# EAGLE design DW-01_lithium_protection (EAGLE 7.4.0)
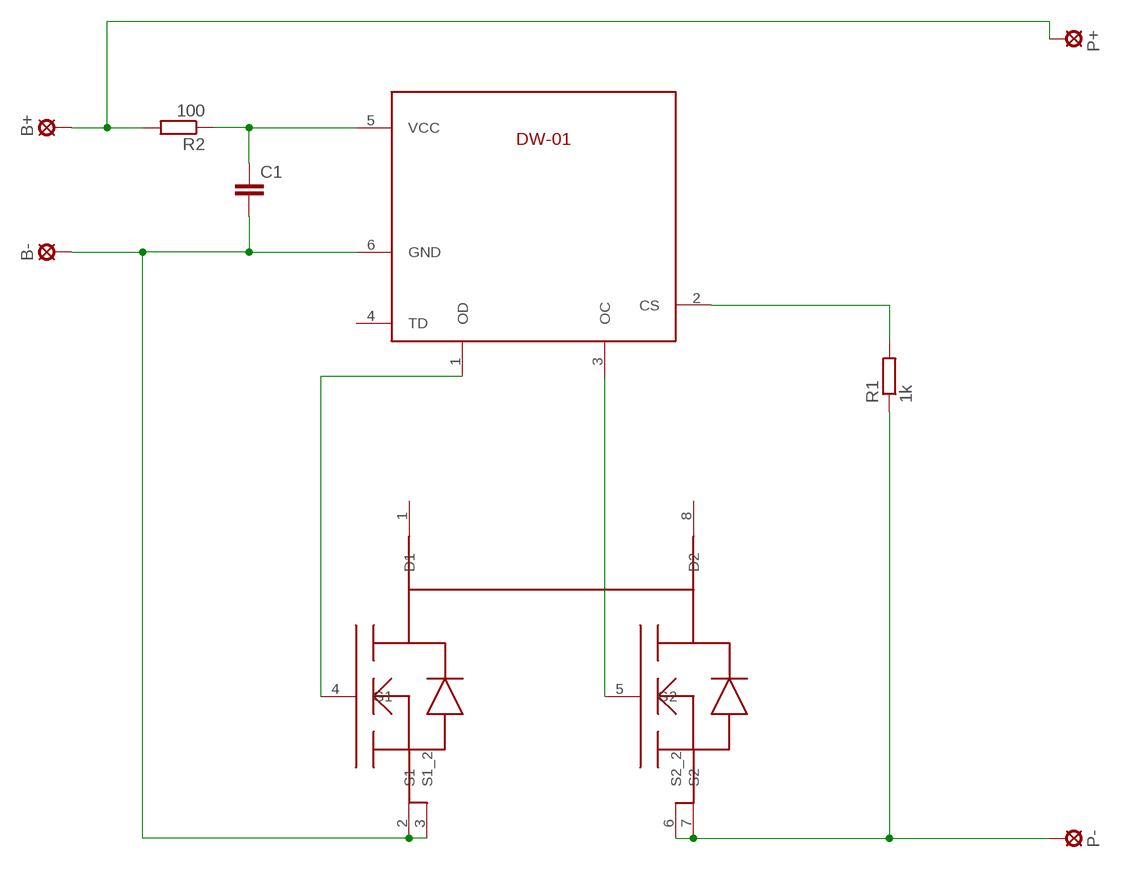
[diagram p0: schematic, sheet 1]

## Parts
B+  LSP10  [LSP10]
B-  LSP10  [LSP10]
C1  C-EUC0603  [C0603]
P+  LSP10  [LSP10]
P-  LSP10  [LSP10]
R1  1k  R-EU_R0603  [R0603]
R2  100  R-EU_R0603  [R0603]
U$1  DW-01  [SOT23-6]
U$2  8205A  [TSSOP8]

## Nets
N$1: U$1.1(OD) U$2.4(G1)
N$2: U$1.3(OC) U$2.5(G2)
N$3: C1.1 R2.1 U$1.5(VCC)
N$4: R1.2 U$1.2(CS)
N$5: P-.MP R1.1 U$2.6(S2_2) U$2.7(S2)
N$6: B-.MP C1.2 U$1.6(GND) U$2.2(S1) U$2.3(S1_2)
N$7: B+.MP P+.MP R2.2
Unconnected: U$1.4(TD) U$2.1(D1) U$2.8(D2)

## Library data of the parts
B+ B- P+ P- = solpad:LSP10: SOLDER PAD drill 1.0 mm, distributor Buerklin, 12H555
C1 = rcl:C-EU: CAPACITOR, European symbol
R1 R2 = rcl:R-EU_: RESISTOR, European symbol
U$1 = DW-01:DW-01
U$2 = 8205A:8205A

## Board
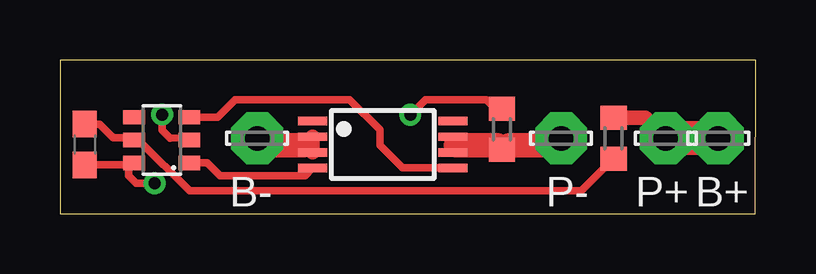
[diagram p1: board, top side]
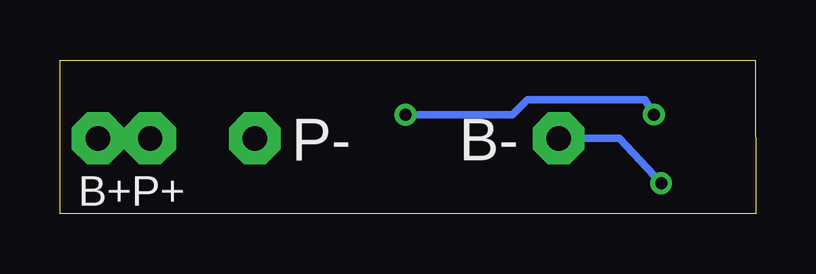
[diagram p2: board, bottom side, seen from below]

Size 29.02 x 6.41 mm. Coordinates in mm from the lower left corner, seen from the top.
Outline: 0,0 29,0 29.02,6.41 0.02,6.41 0,0
Copper layers (1*16): Top 0.035mm / dielectric 1.5mm / Bottom 0.035mm
Design rules "default *": minimum track width 10mil, minimum drill 24mil, track to track 8mil, track to pad 8mil, pad to pad 8mil, via to via 8mil, smd to smd 8mil, copper to edge 40mil, drill to drill 8mil, minimum pad ring 10mil, minimum via ring 8mil, stop-mask expansion 4mil, vias tented up to drill 20mil, thermal gap 10mil

### Footprints (pad centres in the part's own frame; a part is rotated, then mirrored left to right if it is on the bottom)
LSP10 = drill 1.016 pad 2.159 octagon: MP 0,0
C0603 = smd 1.1 x 1: 1 -0.85,0; 2 0.85,0
R0603 = smd 1 x 1.1: 1 -0.85,0; 2 0.85,0
SOT23-6 = smd 0.6 x 0.9: 1 -0.95,-1.15; 2 0,-1.15; 3 0.95,-1.15; 4 0.95,1.15; 5 0,1.15; 6 -0.95,1.15
TSSOP8 = smd 1.2 x 0.35: 1 -2.925,0.975; 2 -2.925,0.325; 3 -2.925,-0.325; 4 -2.925,-0.975; 5 2.925,-0.975; 6 2.925,-0.325; 7 2.925,0.325; 8 2.925,0.975

### Placement (x,y rotation side)
B+  27.44,3.15 0 top
B-  8.23,3.15 180 top
C1  1.03,2.89 270 top
P+  25.26,3.15 0 top
P-  20.89,3.15 0 top
R1  18.43,3.52 90 top
R2  23.07,3.15 90 top
U$1  4.25,3.07 90 top
U$2  13.46,2.89 0 top

### Tracks (layer width: path | path; a pad name or v marks a point on that pad's centre or on a via)
N$1
  Top 0.305: U$1.1 6.13,2.12 6.67,1.59 10.21,1.59 U$2.4
N$2
  Top 0.305: U$2.5 14.28,1.91 13.34,2.86 13.34,3.49 12.07,4.76 7.3,4.76 6.56,4.02 U$1.3
N$3
  Top 0.305: C1.1 1.66,3.74 2.22,3.18 2.99,3.18 U$1.5 3.28,3.07 5.4,0.95 21.73,0.95 R2.1
N$4  (via drill 0.5)
  Top 0.305: R1.2 18.43,4.12 17.78,4.76 15.24,4.76 v14.61,4.13 | v4.26,4.14 4.26,3.49 4.6,3.14 5.29,3.18 U$1.2
  Bottom 0.305: v14.61,4.13 10.16,4.13 9.53,4.76 4.62,4.76 v4.26,4.14
N$5
  Top 0.305: U$2.7 U$2.6 16.38,2.73 16.51,2.86
  Top 1.016: 16.51,2.86 18.24,2.86 R1.1 18.55,2.67 18.73,2.86 20.61,2.86 P-.MP
N$6  (via drill 0.5)
  Top 0.305: C1.2 3.01,2.04 U$1.6 2.86,1.88 2.86,1.59 3.17,1.27 v3.95,1.27 | 10.16,2.86 10.24,2.86 U$2.3
  Top 0.61: U$2.2 U$2.3
  Top 0.813: B-.MP 8.6,3.14 8.89,2.86
  Top 1.016: 8.89,2.86 10.16,2.86
  Bottom 0.305: B-.MP 5.68,3.14 v3.95,1.27
N$7
  Top 0.61: R2.2 24.41,3.99 P+.MP
  Top 1.422: B+.MP P+.MP

### Text on the board
bPlace: B- | P- | P+ | B+